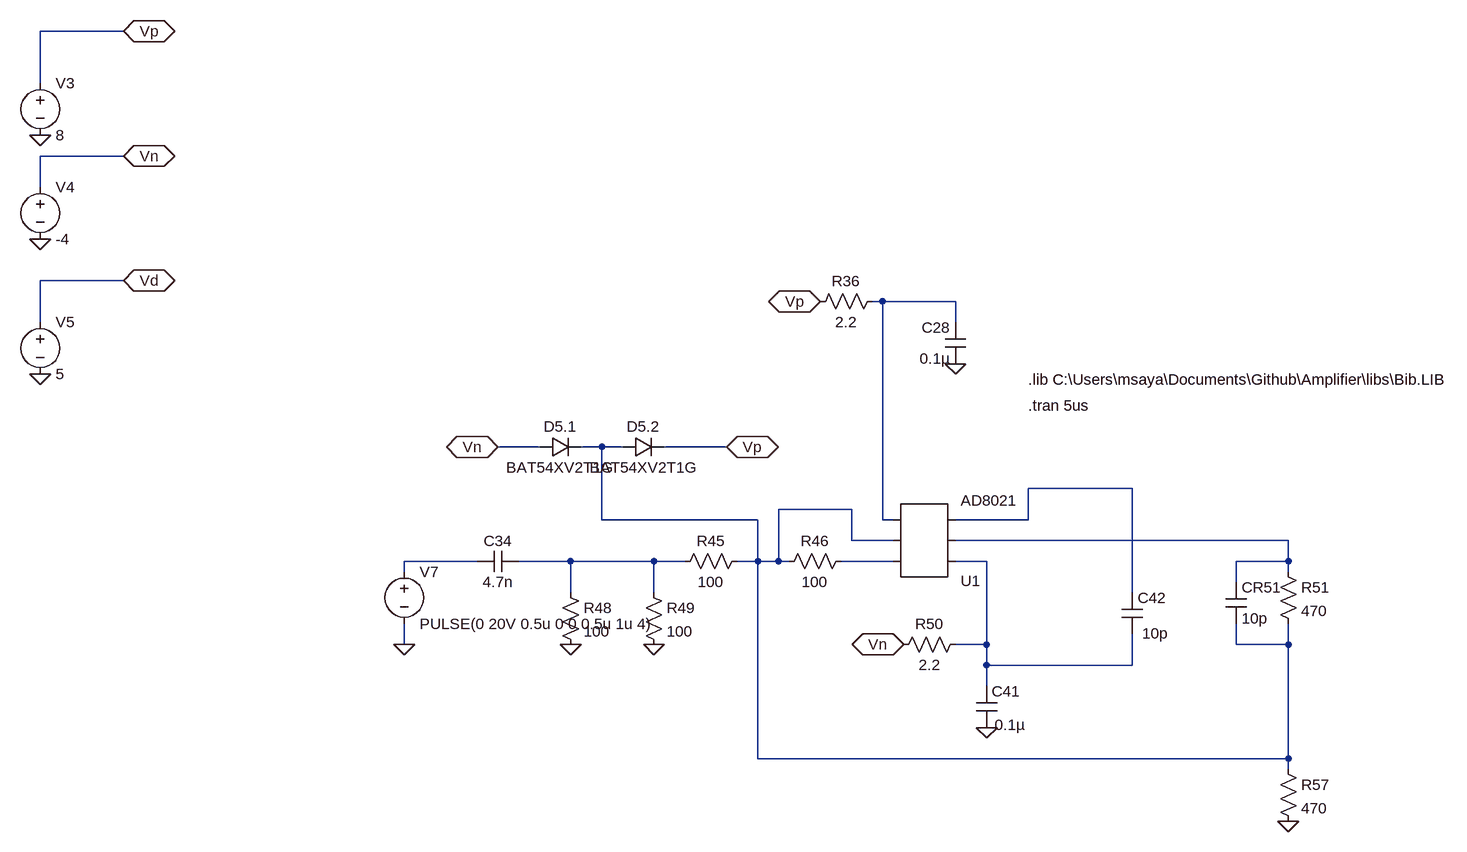
[diagram p0: schematic OV.asc]
OV.asc, the LTspice schematic file:
Version 4
SHEET 1 4920 3300
WIRE -2160 1456 -2288 1456
WIRE -2288 1536 -2288 1456
WIRE -2160 1648 -2288 1648
WIRE -2288 1696 -2288 1648
WIRE -2160 1840 -2288 1840
WIRE -992 1872 -1008 1872
WIRE -880 1872 -992 1872
WIRE -2288 1904 -2288 1840
WIRE -880 1904 -880 1872
WIRE -1520 2096 -1584 2096
WIRE -1424 2096 -1456 2096
WIRE -1392 2096 -1424 2096
WIRE -1232 2096 -1328 2096
WIRE -608 2160 -768 2160
WIRE -1040 2192 -1152 2192
WIRE -1424 2208 -1424 2096
WIRE -1184 2208 -1424 2208
WIRE -992 2208 -992 1872
WIRE -976 2208 -992 2208
WIRE -768 2208 -768 2160
WIRE -768 2208 -880 2208
WIRE -1040 2240 -1040 2192
WIRE -976 2240 -1040 2240
WIRE -368 2240 -880 2240
WIRE -1616 2272 -1728 2272
WIRE -1472 2272 -1552 2272
WIRE -1344 2272 -1472 2272
WIRE -1296 2272 -1344 2272
WIRE -1184 2272 -1184 2208
WIRE -1184 2272 -1216 2272
WIRE -1152 2272 -1152 2192
WIRE -1152 2272 -1184 2272
WIRE -1136 2272 -1152 2272
WIRE -976 2272 -1056 2272
WIRE -832 2272 -880 2272
WIRE -368 2272 -368 2240
WIRE -368 2272 -448 2272
WIRE -1728 2288 -1728 2272
WIRE -368 2288 -368 2272
WIRE -448 2304 -448 2272
WIRE -1472 2320 -1472 2272
WIRE -1344 2320 -1344 2272
WIRE -608 2320 -608 2160
WIRE -1728 2400 -1728 2368
WIRE -832 2400 -832 2272
WIRE -832 2400 -880 2400
WIRE -448 2400 -448 2368
WIRE -368 2400 -368 2368
WIRE -368 2400 -448 2400
WIRE -832 2432 -832 2400
WIRE -608 2432 -608 2384
WIRE -608 2432 -832 2432
WIRE -832 2464 -832 2432
WIRE -1184 2576 -1184 2272
WIRE -368 2576 -368 2400
WIRE -368 2576 -1184 2576
WIRE -368 2592 -368 2576
FLAG -880 1968 0
FLAG -832 2528 0
FLAG -1472 2400 0
FLAG -1344 2400 0
FLAG -368 2672 0
FLAG -2160 1456 Vp
IOPIN -2160 1456 BiDir
FLAG -2160 1648 Vn
IOPIN -2160 1648 BiDir
FLAG -2160 1840 Vd
IOPIN -2160 1840 BiDir
FLAG -1232 2096 Vp
IOPIN -1232 2096 BiDir
FLAG -1088 1872 Vp
IOPIN -1088 1872 BiDir
FLAG -1584 2096 Vn
IOPIN -1584 2096 BiDir
FLAG -960 2400 Vn
IOPIN -960 2400 BiDir
FLAG -2288 1616 0
FLAG -2288 1776 0
FLAG -2288 1984 0
FLAG -1728 2400 0
SYMBOL cap -1552 2256 R90
WINDOW 0 0 32 VBottom 2
WINDOW 3 32 32 VTop 2
SYMATTR InstName C34
SYMATTR Value 4.7n
SYMBOL cap -864 1968 R180
WINDOW 0 24 56 Left 2
WINDOW 3 24 8 Left 2
SYMATTR InstName C28
SYMATTR Value 0.1µ
SYMBOL cap -848 2464 R0
WINDOW 3 28 60 Left 2
SYMATTR Value 0.1µ
SYMATTR InstName C41
SYMBOL cap -624 2320 R0
WINDOW 3 31 63 Left 2
SYMATTR Value 10p
SYMATTR InstName C42
SYMBOL res -1488 2304 R0
SYMATTR InstName R48
SYMATTR Value 100
SYMBOL res -1200 2256 R90
WINDOW 0 0 56 VBottom 2
WINDOW 3 32 56 VTop 2
SYMATTR InstName R45
SYMATTR Value 100
SYMBOL res -1360 2304 R0
SYMATTR InstName R49
SYMATTR Value 100
SYMBOL res -1152 2288 R270
WINDOW 0 32 56 VTop 2
WINDOW 3 0 56 VBottom 2
SYMATTR InstName R46
SYMATTR Value 100
SYMBOL res -992 1856 R90
WINDOW 0 0 56 VBottom 2
WINDOW 3 32 56 VTop 2
SYMATTR InstName R36
SYMATTR Value 2.2
SYMBOL res -864 2384 R90
WINDOW 0 0 56 VBottom 2
WINDOW 3 32 56 VTop 2
SYMATTR InstName R50
SYMATTR Value 2.2
SYMBOL res -384 2576 R0
SYMATTR InstName R57
SYMATTR Value 470
SYMBOL res -384 2272 R0
SYMATTR InstName R51
SYMATTR Value 470
SYMBOL cap -464 2304 R0
SYMATTR InstName CR51
SYMATTR Value 10p
SYMBOL diode -1520 2112 R270
WINDOW 0 32 32 VTop 2
WINDOW 3 0 32 VBottom 2
SYMATTR InstName D5.1
SYMATTR Value BAT54XV2T1G
SYMBOL diode -1392 2112 R270
WINDOW 0 32 32 VTop 2
WINDOW 3 0 32 VBottom 2
SYMATTR InstName D5.2
SYMATTR Value BAT54XV2T1G
SYMBOL voltage -2288 1520 R0
WINDOW 123 0 0 Left 0
WINDOW 39 0 0 Left 0
SYMATTR InstName V3
SYMATTR Value 8
SYMBOL voltage -2288 1680 R0
WINDOW 123 0 0 Left 0
WINDOW 39 0 0 Left 0
SYMATTR InstName V4
SYMATTR Value -4
SYMBOL voltage -2288 1888 R0
WINDOW 123 0 0 Left 0
WINDOW 39 0 0 Left 0
SYMATTR InstName V5
SYMATTR Value 5
SYMBOL AutoGenerated\\AD8021 -928 2240 M180
SYMATTR InstName U1
SYMBOL voltage -1728 2272 R0
WINDOW 123 0 0 Left 0
WINDOW 39 0 0 Left 0
SYMATTR InstName V7
SYMATTR Value PULSE(0 20V 0.5u 0 0 0.5u 1u 4)
TEXT -768 2032 Left 2 !.tran 5us
TEXT -768 1992 Left 2 !.lib C:\\Users\\msaya\\Documents\\Github\\Amplifier\\libs\\Bib.LIB

The netlist it stands for:
* OV.asc
C34 N006 N005 4.7n
C28 0 N001 0.1µ
C41 N008 0 0.1µ
C42 N003 N008 10p
R48 N006 0 100
R45 N002 N006 100
R49 N006 0 100
R46 N002 N007 100
R36 N001 Vp 2.2
R50 N008 Vn 2.2
R57 N002 0 470
R51 N004 N002 470
CR51 N004 N002 10p
D5.1 Vn N002 BAT54XV2T1G
D5.2 N002 Vp BAT54XV2T1G
V3 Vp 0 8
V4 Vn 0 -4
V5 Vd 0 5
* U1: AD8021 (symbol AutoGenerated\AD8021 not available, pins judged from their places): pin1=N007 pin2=N002 pin3=N001 pin4=N008 pin5=N004 pin6=N003
V7 N005 0 PULSE(0 20V 0.5u 0 0 0.5u 1u 4)
.model D D
.lib standard.dio
.tran 5us
.lib C:\Users\msaya\Documents\Github\Amplifier\libs\Bib.LIB
.backanno
.end